# EAGLE schematic eilzugwagen (EAGLE 9.5.2)
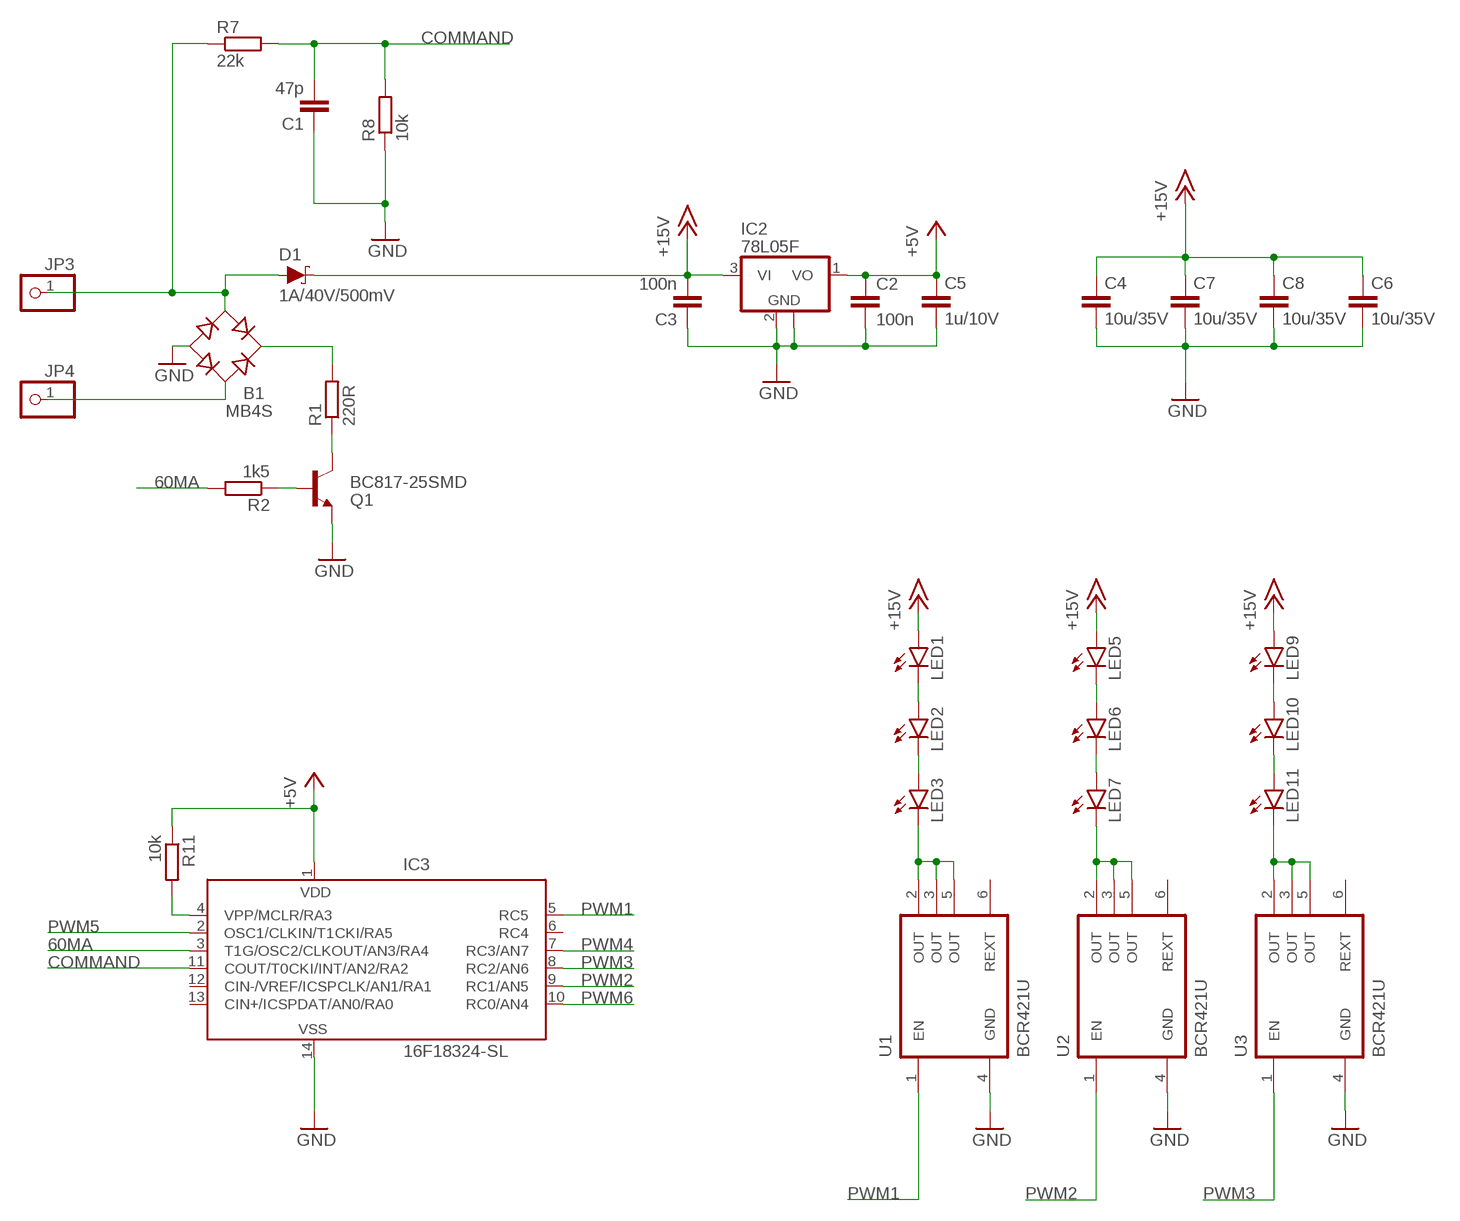
[diagram p0: schematic, sheet 1]

## Parts
B1  MB4S  [SOIC-4]
C1  47p  C-EUC0805  [C0805]
C2  100n  C-EUC3216  [C3216]
C3  100n  C-EUC3216  [C3216]
C4  10u/35V  C-EUC3216  [C3216]
C5  1u/10V  C-EUC3216  [C3216]
C6  10u/35V  C-EUC3216  [C3216]
C7  10u/35V  C-EUC3216  [C3216]
C8  10u/35V  C-EUC3216  [C3216]
D1  1A/40V/500mV  DIODE-SCHOTTKY-SS14  [SMA-DIODE]
IC2  78L05F  [SOT89]
IC3  16F18324-SL  PIC16F676SL  [SO-14]
JP3  PINHD-1X1  [1X01]
JP4  PINHD-1X1  [1X01]
LED1  LEDKA-3528ASYC  [KA-3528ASYC]
LED2  LEDKA-3528ASYC  [KA-3528ASYC]
LED3  LEDKA-3528ASYC  [KA-3528ASYC]
LED5  LEDKA-3528ASYC  [KA-3528ASYC]
LED6  LEDKA-3528ASYC  [KA-3528ASYC]
LED7  LEDKA-3528ASYC  [KA-3528ASYC]
LED9  LEDKA-3528ASYC  [KA-3528ASYC]
LED10  LEDKA-3528ASYC  [KA-3528ASYC]
LED11  LEDKA-3528ASYC  [KA-3528ASYC]
Q1  BC817-25SMD  [SOT23-BEC]
R1  220R  R-EU_R1206  [R1206]
R2  1k5  R-EU_R1206  [R1206]
R7  22k  R-EU_R1206  [R1206]
R8  10k  R-EU_R1206  [R1206]
R11  10k  R-EU_R1206  [R1206]
U1  BCR421U  [SC74-6]
U2  BCR421U  [SC74-6]
U3  BCR421U  [SC74-6]

## Nets
60MA: IC3.3(T1G/OSC2/CLKOUT/AN3/RA4) R2.2
+5V: C2.1 C5.1 IC2.1(VO) IC3.1(VDD) R11.1
+15V: C3.2 C4.1 C6.1 C7.1 C8.1 D1.C IC2.3(VI) LED1.A LED5.A LED9.A
COMMAND: C1.2 IC3.11(COUT/T0CKI/INT/AN2/RA2) R7.2 R8.2
GND: B1.- C1.1 C2.2 C3.1 C4.2 C5.2 C6.2 C7.2 C8.2 IC2.2(GND) IC2.2@1(GND) IC3.14(VSS) Q1.E R8.1 U1.4(GND) U2.4(GND) U3.4(GND)
N$1: B1.~2(AC2) JP4.1
N$2: B1.~1(AC1) D1.A JP3.1 R7.1
N$3: Q1.C R1.1
N$4: Q1.B R2.1
N$5: B1.+ R1.2
N$16: LED10.C LED11.A
N$19: LED6.C LED7.A
N$20: LED2.C LED3.A
N$21: LED1.C LED2.A
N$22: LED5.C LED6.A
N$23: LED9.C LED10.A
N$28: IC3.4(VPP/MCLR/RA3) R11.2
N$30: LED3.C U1.2(OUT) U1.3(OUT) U1.5(OUT)
N$31: LED11.C U3.2(OUT) U3.3(OUT) U3.5(OUT)
N$32: LED7.C U2.2(OUT) U2.3(OUT) U2.5(OUT)
PWM1: IC3.5(RC5) U1.1(EN)
PWM2: IC3.9(RC1/AN5) U2.1(EN)
PWM3: IC3.8(RC2/AN6) U3.1(EN)
PWM4: IC3.7(RC3/AN7)
PWM5: IC3.2(OSC1/CLKIN/T1CKI/RA5)
PWM6: IC3.10(RC0/AN4)
Unconnected: IC3.6(RC4) IC3.12(CIN-/VREF/ICSPCLK/AN1/RA1) IC3.13(CIN+/ICSPDAT/AN0/RA0) U1.6(REXT) U2.6(REXT) U3.6(REXT)

## Library data of the parts
B1 = rectifier:MB*S: Bridge Rectifier Source: http://www.fairchildsemi.com/ds/MB/MB6S.pdf
C1-C8 = rcl:C-EU: CAPACITOR, European symbol; SPICEPREFIX: C
D1 = SparkFun-DiscreteSemi:DIODE-SCHOTTKY: Schottky diode A Schottky diode is a semiconductor diode which has a low forward voltage drop and a very fast switching action.; PROD_ID: DIO-08053
IC2 = linear:78L*: POSITOIV-VOLTAGE REGULATORS Output up to 100 mA Source: Datasheet <http://focus.ti.com/lit/ds/symlink/ua78l05.pdf>
IC3 = microchip:PIC16F676: 14-Pin, Flash-Based 8-Bit CMOS Microcontroller High Performance RISC CPU: * Only 35 instructions to learn - All single-cycle instructions except branches * Operating speed: - DC - 20 MHz oscillator/clock input - DC - 200 ns instruction cycle * Internal and external oscillator options - Precision Internal 4 MHz oscillator factory calibrated to ±1% - External Oscillator support for crystals and resonators - 5?s wake-up from SLEEP, 3.0V, typical * Power saving SLEEP mode * Wide operating voltage range - 2.0V to 5.5V * Industrial and Extended temperature range * Low power Power-on Reset (POR) * Power-up Timer (PWRT) and Oscillator Start-up Timer (OST) * Brown-out Detect (BOD) * Watchdog Timer (WDT) with independent oscillator for reliable operation * Multiplexed MCLR/Input-pin * Interrupt-on-pin change * Individual programmable weak pull-ups * Programmable code protection * High Endurance FLASH/EEPROM Cell - 100,000 write FLASH endurance - 1,000,000 write EEPROM endurance - FLASH/Data EEPROM Retention: > 40 years * Standby Current: - 1 nA @ 2.0V, typical * Operating Current: - 8.5?A @ 32 kHz, 2.0V, typical - 100?A @ 1 MHz, 2.0V, typical * Watchdog Timer Current - 300 nA @ 2.0V, typical * Timer1 oscillator current: - 4?A @ 32 kHz, 2.0V, typical * 12 I/O pins with individual direction control * High current sink/source for direct LED drive * Analog-to-Digital Converter module (PIC16F676): - 10-bit resolution - Programmable 8-channel input - Voltage reference input * In-Circuit Serial ProgrammingTM (ICSPTM) via two pins Source: http://ww1.microchip.com/downloads/en/DeviceDoc/40039E.pdf; MF: MICROCHIP; MPN: PIC16F676-I/SL; OC_FARNELL: 9760520; OC_NEWARK: 92C4557
JP3 JP4 = pinhead:PINHD-1X1: PIN HEADER
LED1-LED3 LED5-LED7 LED9-LED11 = led:LED: LED OSRAM: - CHIPLED LG R971, LG N971, LY N971, LG Q971, LY Q971, LO R971, LY R971 LH N974, LH R974 LS Q976, LO Q976, LY Q976 LO Q996 - Hyper CHIPLED LW Q18S LB Q993, LB Q99A, LB R99A - SideLED LS A670, LO A670, LY A670, LG A670, LP A670 LB A673, LV A673, LT A673, LW A673 LH A674 LY A675 LS A676, LA A676, LO A676, LY A676, LW A676 LS A679, LY A679, LG A679 - Hyper Micro SIDELED® LS Y876, LA Y876, LO Y876, LY Y876 LT Y87S - SmartLED LW L88C, LW L88S LB L89C, LB L89S, LG L890 LS L89K, LO L89K, LY L89K LS L896, LA L896, LO L896, LY L896 - TOPLED LS T670, LO T670, LY T670, LG T670, LP T670 LSG T670, LSP T670, LSY T670, LOP T670, LYG T670 LG T671, LOG T671, LSG T671 LB T673, LV T673, LT T673, LW T673 LH T674 LS T676, LA T676, LO T676, LY T676, LB T676, LH T676, LSB T676, LW T676 LB T67C, LV T67C, LT T67C, LS T67K, LO T67K, LY T67K, LW E67C LS E67B, LA E67B, LO E67B, LY E67B, LB E67C, LV E67C, LT E67C LW T67C LS T679, LY T679, LG T679 LS T770, LO T770, LY T770, LG T770, LP T770 LB T773, LV T773, LT T773, LW T773 LH T774 LS E675, LA E675, LY E675, LS T675 LS T776, LA T776, LO T776, LY T776, LB T776 LHGB T686 LT T68C, LB T68C - Hyper Mini TOPLED® LB M676 - Mini TOPLED Santana® LG M470 LS M47K, LO M47K, LY M47K Source: http://www.osram.convergy.de LUXEON: - LUMILED® LXK2-PW12-R00, LXK2-PW12-S00, LXK2-PW14-U00, LXK2-PW14-V00 LXK2-PM12-R00, LXK2-PM12-S00, LXK2-PM14-U00 LXK2-PE12-Q00, LXK2-PE12-R00, LXK2-PE12-S00, LXK2-PE14-T00, LXK2-PE14-U00 LXK2-PB12-K00, LXK2-PB12-L00, LXK2-PB12-M00, LXK2-PB14-N00, LXK2-PB14-P00, LXK2-PB14-Q00 LXK2-PR12-L00, LXK2-PR12-M00, LXK2-PR14-Q00, LXK2-PR14-R00 LXK2-PD12-Q00, LXK2-PD12-R00, LXK2-PD12-S00 LXK2-PH12-R00, LXK2-PH12-S00 LXK2-PL12-P00, LXK2-PL12-Q00, LXK2-PL12-R00 Source: www.luxeon.com KINGBRIGHT: KA-3528ASYC Source: www.kingbright.com
Q1 = transistor-npn:BC817*: NPN Transistor
R1 R2 R7 R8 R11 = rcl:R-EU_: RESISTOR, European symbol; SPICEPREFIX: R
U1-U3 = BCR421U:BCR421U: LED DRIVER; AVAILABILITY: Unavailable; DESCRIPTION: LED Driver IC 1 Output Linear PWM Dimming 350mA SOT-26; MF: Infineon; MP: BCR421U; PACKAGE: SC-74 Infineon; PRICE: None